# EasyEDA Pro project DreamFly.eprj, schematic Schematic1
Board Name: Board1; Create Date: 2024-08-14; Page Name: DreamFly Main Body; Project Name: DreamFly; Schematic Name: Schematic1; Update Date: 2024-12-17; Company: 嘉立创EDA; Drawed: 梅雨; Page Size: A4; Version: V1.0
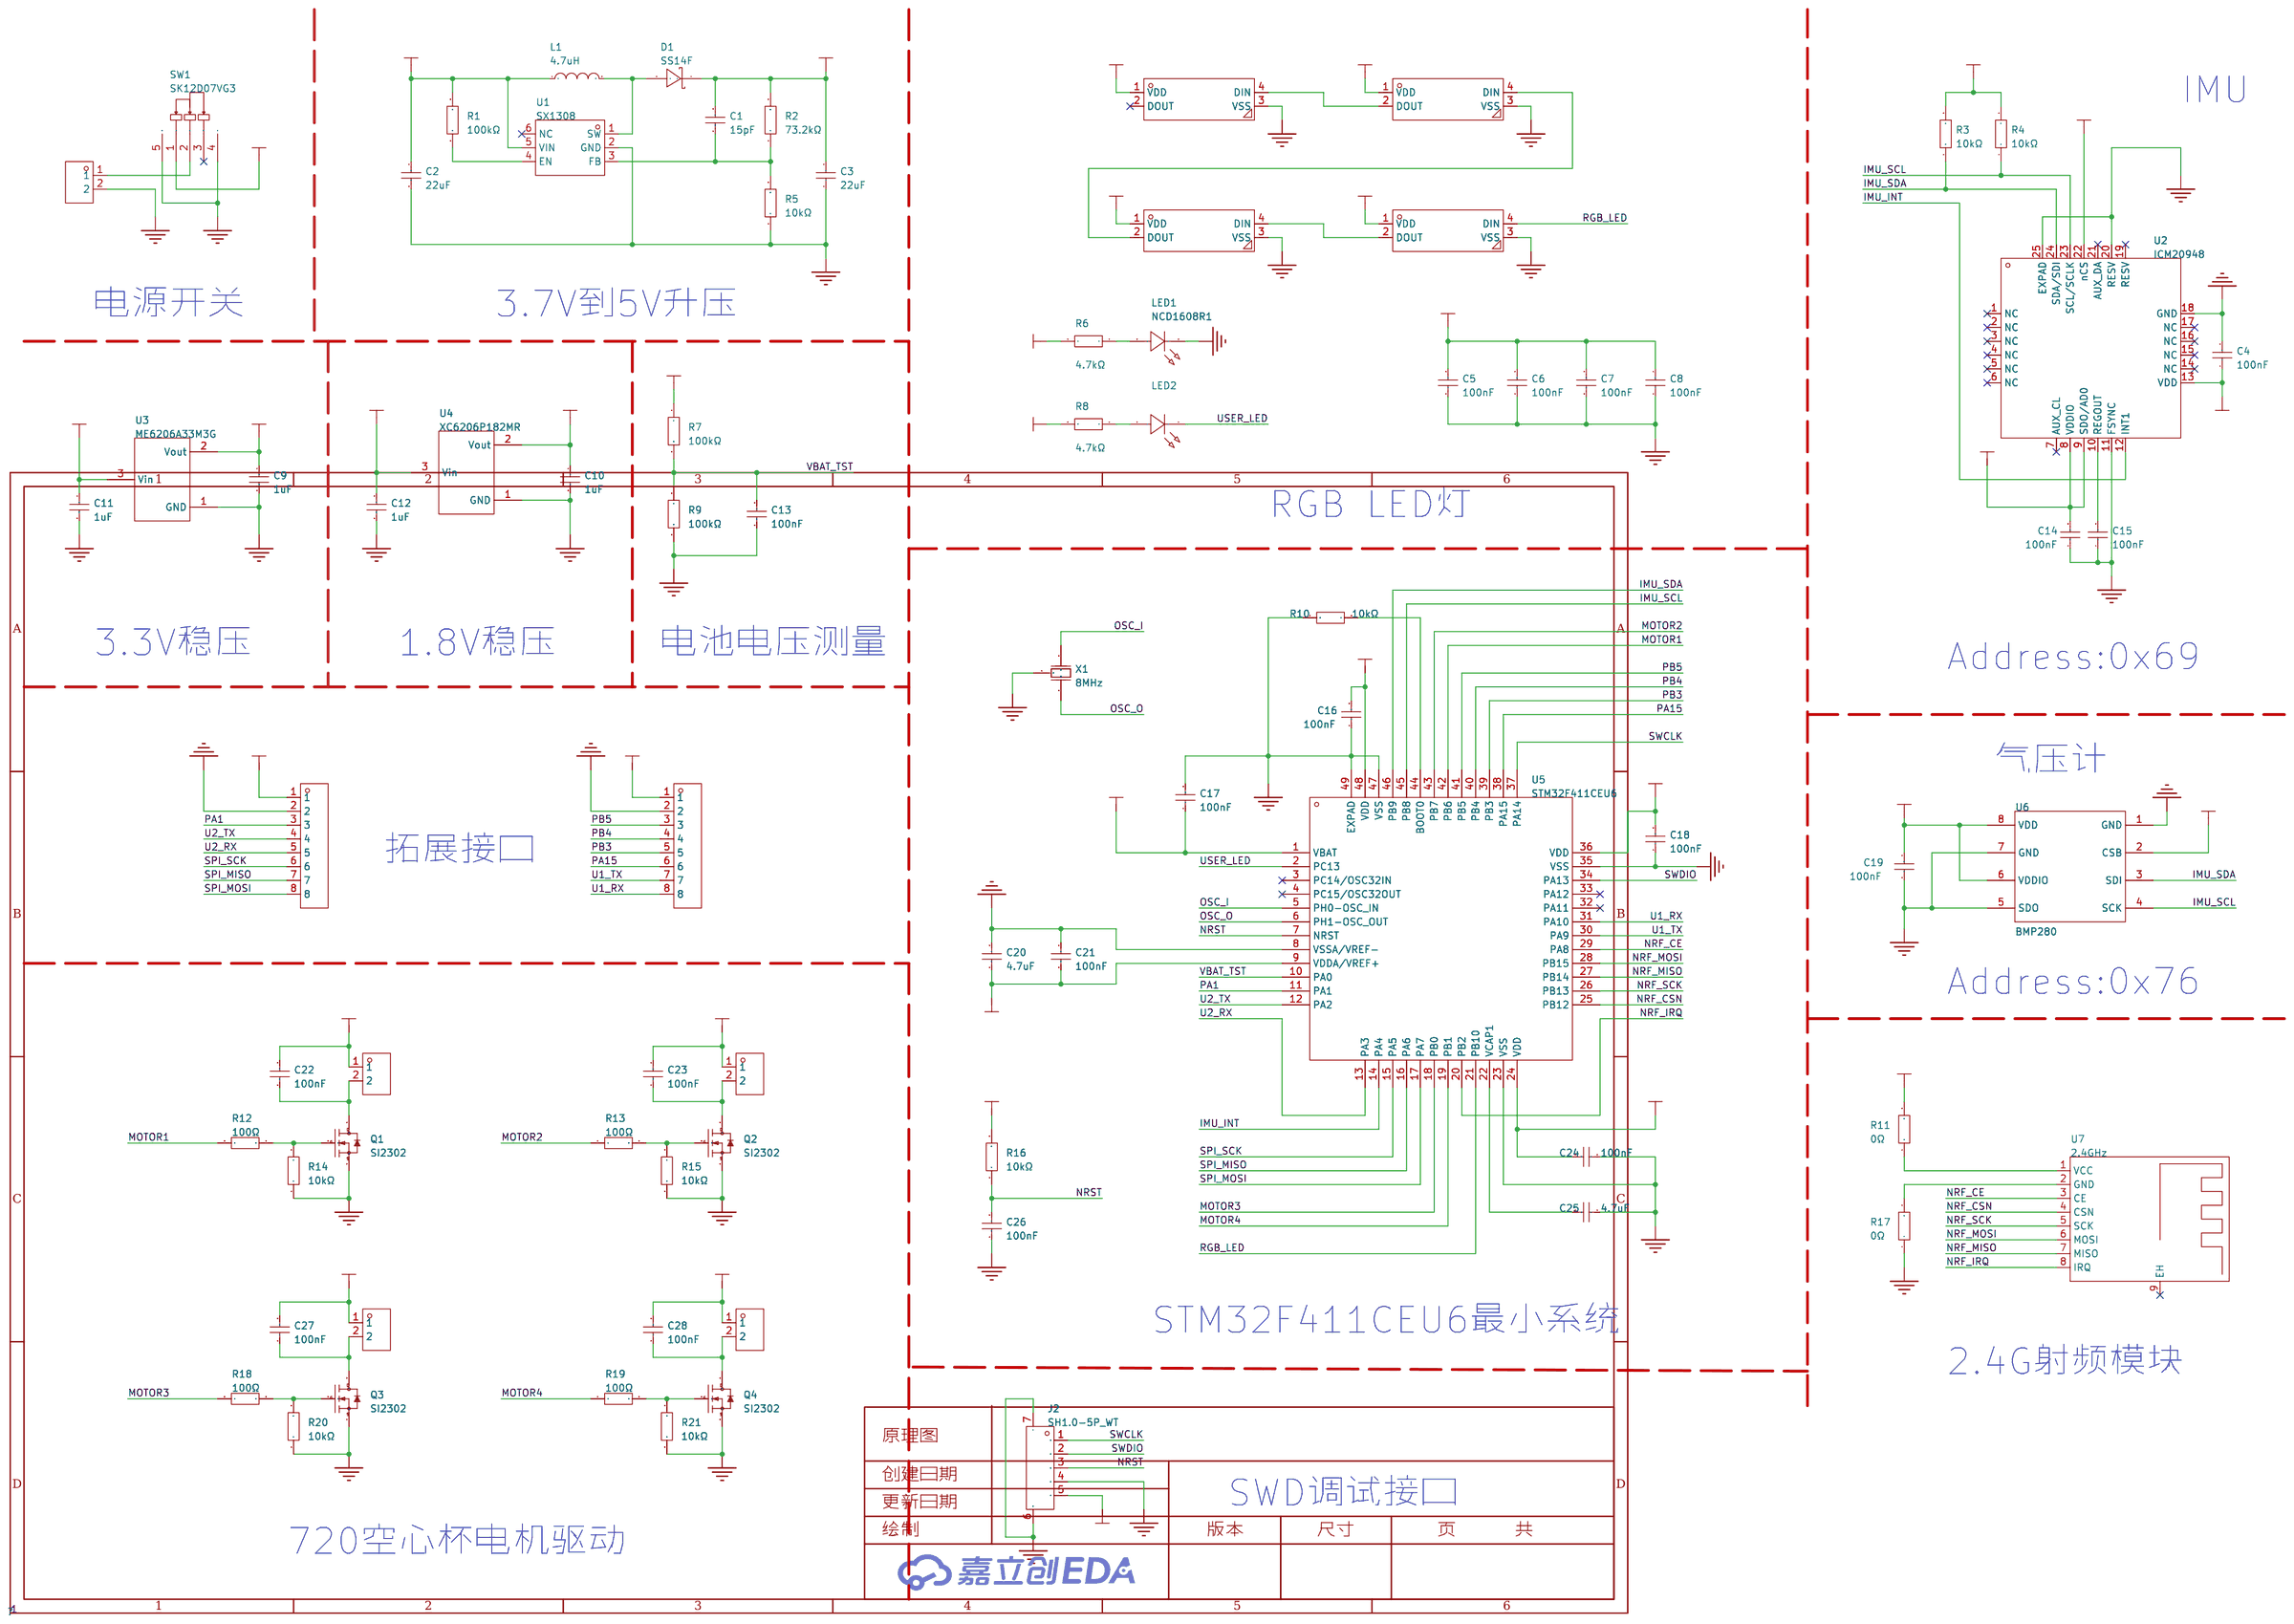
[diagram p0: schematic sheet]

## Parts
C1  15pF  [C0603]
C2  22uF  [C0603]
C3  22uF  [C0603]
C4  100nF  [C0603]
C5  100nF  [C0603]
C6  100nF  [C0603]
C7  100nF  [C0603]
C8  100nF  [C0603]
C9  1uF  [C0603]
C10  1uF  [C0603]
C11  1uF  [C0603]
C12  1uF  [C0603]
C13  100nF  [C0603]
C14  100nF  [C0603]
C15  100nF  [C0603]
C16  100nF  [C0603]
C17  100nF  [C0603]
C18  100nF  [C0603]
C19  100nF  [C0603]
C20  4.7uF  [C0603]
C21  100nF  [C0603]
C22  100nF  [C0603]
C23  100nF  [C0603]
C24  100nF  [C0603]
C25  4.7uF  [C0603]
C26  100nF  [C0603]
C27  100nF  [C0603]
C28  100nF  [C0603]
D1  SS14F  [SMAF_L3.5-W2.6-LS4.7-RD]
J1  BAT  [BAT]
J2  SH1.0-5P_WT  [CONN-SMD_5P-P1.00_BX-SH1.0-5PWT]
L1  4.7uH  [IND-SMD_L4.9-W4.4_MAPM0420F]
LED1  NCD1608R1  [LED0603-RD_RED]
LED2  NCD1608A1  [LED0603-RD]
M1  720_MOTOR  [motor]
M2  720_MOTOR  [motor]
M3  720_MOTOR  [motor]
M4  720_MOTOR  [motor]
P1  -  [header10-2.0mm]
P2  -  [header10-2.0mm]
Q1  SI2302  [SOT-23-3_L2.9-W1.3-P1.90-LS2.4-BR]
Q2  SI2302  [SOT-23-3_L2.9-W1.3-P1.90-LS2.4-BR]
Q3  SI2302  [SOT-23-3_L2.9-W1.3-P1.90-LS2.4-BR]
Q4  SI2302  [SOT-23-3_L2.9-W1.3-P1.90-LS2.4-BR]
R1  100kΩ  [R0603]
R2  73.2kΩ  [R0603]
R3  10kΩ  [R0603]
R4  10kΩ  [R0603]
R5  10kΩ  [R0603]
R6  4.7kΩ  [R0603]
R7  100kΩ  [R0603]
R8  4.7kΩ  [R0603]
R9  100kΩ  [R0603]
R10  10kΩ  [R0603]
R11  0Ω  [R0603]
R12  100Ω  [R0603]
R13  100Ω  [R0603]
R14  10kΩ  [R0603]
R15  10kΩ  [R0603]
R16  10kΩ  [R0603]
R17  0Ω  [R0603]
R18  100Ω  [R0603]
R19  100Ω  [R0603]
R20  10kΩ  [R0603]
R21  10kΩ  [R0603]
RGB1  WS2812B  [LED-SMD_4P-L5.0-W5.0-BL_TC5050RGB]
RGB2  WS2812B  [LED-SMD_4P-L5.0-W5.0-BL_TC5050RGB]
RGB3  WS2812B  [LED-SMD_4P-L5.0-W5.0-BL_TC5050RGB]
RGB4  WS2812B  [LED-SMD_4P-L5.0-W5.0-BL_TC5050RGB]
SW1  SK12D07VG3  [SW-TH_SK12D07VG3]
U1  SX1308  [SOT-23-6_L2.9-W1.6-P0.95-LS2.8-BL]
U2  ICM20948  [qfn24-0.4]
U3  ME6206A33M3G  [SOT-23-3_L2.9-W1.6-P1.90-LS2.8-BR]
U4  XC6206P182MR  [SOT-23-3_L2.9-W1.6-P1.90-LS2.8-BR]
U5  STM32F411CEU6  [qfn48]
U6  BMP280  [LGA-2_5X2MM]
U7  2.4GHz  [WIRELM-SMD_AI-THINKER_NF-03]
X1  8MHz  [OSC-SMD_3P-L3.2-W1.3-P1.20-L]

## Library data of the parts
C1 = CL10C150JB8NNNC: 容值:15pF;精度:±5%;额定电压:50V;材质(温度系数):C0G;; LCSC Part Name: 15pF ±5% 50V; Supplier Part: C1644; Manufacturer: SAMSUNG(三星); Supplier Footprint: 0603; JLCPCB Part Class: Basic Part; Datasheet: https://atta.szlcsc.com/upload/public/pdf/source/20160218/1457707763339.pdf; Supplier: LCSC; Tolerance: ±5%; Voltage Rated: 50V; Temperature Coefficient: C0G
C2 C3 = CL10A226MP8NUNE: 容值:22uF;精度:±20%;额定电压:10V;材质(温度系数):X5R;; LCSC Part Name: 22uF ±20% 10V; Supplier Part: C86295; Manufacturer: SAMSUNG(三星); Supplier Footprint: 0603; JLCPCB Part Class: Extended Part; Datasheet: https://atta.szlcsc.com/upload/public/pdf/source/20160218/1457707763339.pdf; Supplier: LCSC; Tolerance: ±20%; Voltage Rated: 10V; Temperature Coefficient: X5R
C4-C8 C13-C19 C21-C24 C26-C28 = CL10B104KB8NNNC: 容值:100nF;精度:±10%;额定电压:50V;材质(温度系数):X7R;; LCSC Part Name: 100nF ±10% 50V; Supplier Part: C1591; Manufacturer: SAMSUNG(三星); Supplier Footprint: 0603; JLCPCB Part Class: Extended Part; Datasheet: https://atta.szlcsc.com/upload/public/pdf/source/20160218/1457707763339.pdf; Supplier: LCSC; Tolerance: ±10%; Voltage Rated: 50V; Temperature Coefficient: X7R
C9-C12 = CL10A105KB8NNNC: 容值:1uF;精度:±10%;额定电压:50V;材质(温度系数):X5R;; LCSC Part Name: 1uF ±10% 50V; Supplier Part: C15849; Manufacturer: SAMSUNG(三星); Supplier Footprint: 0603; JLCPCB Part Class: Basic Part; Datasheet: https://atta.szlcsc.com/upload/public/pdf/source/20160218/1457707763339.pdf; Supplier: LCSC; Tolerance: ±10%; Voltage Rated: 50V; Temperature Coefficient: X5R
C20 C25 = CL10A475KP8NNNC: 容值:4.7uF;精度:±10%;额定电压:10V;材质(温度系数):X5R;; LCSC Part Name: 4.7uF ±10% 10V; Supplier Part: C1705; Manufacturer: SAMSUNG(三星); Supplier Footprint: 0603; JLCPCB Part Class: Extended Part; Datasheet: https://atta.szlcsc.com/upload/public/pdf/source/20160218/1457707763339.pdf; Supplier: LCSC; Tolerance: ±10%; Voltage Rated: 10V; Temperature Coefficient: X5R
D1 = SS14F_C64880: 正向压降(Vf):550mV@1A;直流反向耐压(Vr):40V;平均整流电流(Io):1A;; LCSC Part Name: 电压:40V 电流:1A; Supplier Part: C64880; Manufacturer: MDD; Supplier Footprint: SMAF; JLCPCB Part Class: 扩展库; Datasheet: https://atta.szlcsc.com/upload/public/pdf/source/20230823/E8EB324D9FAAE659A2B5393973A101D8.pdf; Supplier: LCSC; Forward Voltage (Vf@If): 550mV@1A; Reverse Voltage (Vr): 40V; Average Rectified Current (Io): 1A
J1 = BAT
J2 = BX-SH1.0-5PWT: 插针结构:1x5P;间距:1mm;安装方式:卧贴;参考系列:SH;总PIN数:5P;排数:1;每排PIN数:5;行距:-;额定电流:1A;触头材质:黄铜;触头镀层:锡;工作温度范围:-25℃~+85℃;; Supplier Part: C18077911; Manufacturer: Bossie(博锡); Supplier Footprint: SMD,P=1mm,卧贴; JLCPCB Part Class: Extended Part; Datasheet: https://atta.szlcsc.com/upload/public/pdf/source/20231017/4CDB0A212BD50B56D4BC69924E3F273B.pdf; Supplier: LCSC; Pins Structure: 1x5P; Pitch: 1mm; Mounting Style: 卧贴; Reference Series: SH; Number of Pins: 5P; Number of Rows: 1; Number of PINs Per Row: 5; Current Rating (Max): 1A; Contact Material: 黄铜; Contact Plating: 锡; Operating Temperature Range: -25℃~+85℃
L1 = HA42-4R7MT: LCSC Part Name: 4.7uH ±20% 3A; Supplier Part: C2936653; Manufacturer: FH(风华); Supplier Footprint: 0420; JLCPCB Part Class: 扩展库; Datasheet: https://atta.szlcsc.com/upload/public/pdf/source/20211228/DF5AAD1C624D1DACD739A51BD94418BC.pdf; Supplier: LCSC; Tolerance: ±20%; Rated Current: 2A; Saturation Current (Isat): 3A; DC Resistance (DCR): 150mΩ
LED1 = NCD1608R1: 发光颜色:橙红色;正向电压(VF):1.9V;功率:57mW;正向电流:5mA;主波长:625nm;二极管配置:-;透镜颜色:-;色温:-;发光强度:30mcd;发光角度:120°;载带方式:-;工作温度:-30℃~+85℃;; Supplier Part: C2917174; Manufacturer: 国星光电; Supplier Footprint: 0603; JLCPCB Part Class: 扩展库; Datasheet: https://atta.szlcsc.com/upload/public/pdf/source/20211124/3B62A3FE98FF7E40CFCCFB520391D3D0.pdf; Supplier: LCSC; Emitted Color: 橙红色; Forward Voltage (VF): 1.9V; Power Dissipation: 57mW; Forward Current: 5mA; Dominant Wavelength: 625nm; Peak Wavelength: 635nm; Luminous Intensity: 30mcd; Viewing Angle: 120°; Operating Temperature: -30℃~+85℃
LED2 = NCD1608A1: 灯头类型:-;发光颜色:冰蓝色;正向电压(VF):2.7V~3.3V;功率:82.5mW;正向电流:25mA;主波长:-;二极管配置:-;透镜颜色:雾状黄透镜;色温:-;发光强度:125mcd~260mcd;发光角度:130°;载带方式:-;工作温度:-40℃~+85℃;; Supplier Part: C5382145; Manufacturer: 国星光电; Supplier Footprint: 0603; Datasheet: https://atta.szlcsc.com/upload/public/pdf/source/20230320/57E8B4D582D472ED3A7933DBAC44AEC7.pdf; Supplier: LCSC; Emitted Color: 冰蓝色; Forward Voltage (VF): 2.7V~3.3V; Power Dissipation: 82.5mW; Forward Current: 25mA; Lens Color: 雾状黄透镜; Luminous Intensity: 125mcd~260mcd; Viewing Angle: 130°; Operating Temperature: -40℃~+85℃
M1-M4 = 1.25-2A: LCSC Part Name: 2P 1.25mm; Supplier Part: C2829702; Manufacturer: FG(富港); Supplier Footprint: 插件,P=1.25mm; JLCPCB Part Class: 扩展库; Supplier: LCSC
P1 P2 = PM200V-11-08-H43: 插孔结构:1x8P;间距:2mm;行距:-;圆孔/方孔:方孔;安装类型:直插;排数:单排;总孔位数:8P;额定电流:2A;额定电压:-;插孔方向:顶部;塑高:4.3mm;工作温度范围:-40℃~+105℃;; LCSC Part Name: 间距:2mm 1x8P 直插; Supplier Footprint: 插件,P=2mm; JLCPCB Part Class: 扩展库; Datasheet: https://atta.szlcsc.com/upload/public/pdf/source/20201127/C962324_279235CD91B6BC5DCAC73F646CF096CF.pdf; Holes Structure: 1x8P; Pitch: 2mm; Circular Hole / Square Hole: 方孔; Mounting Type: 直插; Number of Rows: 单排; Number of Holes: 8P; Current Rating (Max): 2A; Holes Direction: 顶部; Insulation Height: 4.3mm; Operating Temperature Range: -40℃~+105℃
Q1-Q4 = SI2302_C181087: 类型:1个N沟道;漏源电压(Vdss):20V;连续漏极电流(Id):2.1A;功率(Pd):400mW;导通电阻(RDS(on)@Vgs,Id):72mΩ@4.5V,3.6A;阈值电压(Vgs(th)@Id):1.2V@50uA;; LCSC Part Name: 1个N沟道 耐压:20V 电流:2.1A; Supplier Part: C181087; Manufacturer: Hottech(合科泰); Supplier Footprint: SOT-23; JLCPCB Part Class: 扩展库; Datasheet: https://atta.szlcsc.com/upload/public/pdf/source/20180131/C181087_15173931927061329216.pdf; Supplier: LCSC; Type: 1个N沟道; Drain Source Voltage (Vdss): 20V; Continuous Drain Current (Id): 2.1A; Power Dissipation (Pd): 400mW; Drain Source On Resistance (RDS(on)@Vgs,Id): 72mΩ@4.5V,3.6A; Gate Threshold Voltage (Vgs(th)@Id): 1.2V@50uA
R1 R7 R9 = 0603WAF1003T5E: 电阻类型:厚膜电阻;阻值:100kΩ;精度:±1%;功率:100mW;最大工作电压:75V;温度系数:±100ppm/℃;; LCSC Part Name: 100kΩ ±1% 100mW 厚膜电阻; Supplier Part: C25803; Manufacturer: UNI-ROYAL(厚声); Supplier Footprint: 0603; JLCPCB Part Class: Basic Part; Datasheet: https://atta.szlcsc.com/upload/public/pdf/source/20200306/C422600_1E6D84923E4A46A82E41ADD87F860B5C.pdf; Supplier: LCSC; Type: 厚膜电阻; Tolerance: ±1%; Power(Watts): 100mW; Overload Voltage (Max): 75V; Temperature Coefficient: ±100ppm/℃; Operating Temperature Range: -55℃~+155℃
R2 = 0603WAF7322T5E: 电阻类型:厚膜电阻;阻值:73.2kΩ;精度:±1%;功率:100mW;最大工作电压:75V;温度系数:±100ppm/℃;; LCSC Part Name: 73.2kΩ ±1% 100mW 厚膜电阻; Supplier Part: C14890; Manufacturer: UNI-ROYAL(厚声); Supplier Footprint: 0603; JLCPCB Part Class: Extended Part; Datasheet: https://atta.szlcsc.com/upload/public/pdf/source/20200306/C422600_1E6D84923E4A46A82E41ADD87F860B5C.pdf; Supplier: LCSC; Type: 厚膜电阻; Tolerance: ±1%; Power(Watts): 100mW; Overload Voltage (Max): 75V; Temperature Coefficient: ±100ppm/℃; Operating Temperature Range: -55℃~+155℃
R3 R4 R6 R8 = 0603WAF4701T5E: 电阻类型:厚膜电阻;阻值:4.7kΩ;精度:±1%;功率:100mW;最大工作电压:75V;温度系数:±100ppm/℃;; LCSC Part Name: 4.7kΩ ±1% 100mW 厚膜电阻; Supplier Part: C23162; Manufacturer: UNI-ROYAL(厚声); Supplier Footprint: 0603; JLCPCB Part Class: Basic Part; Datasheet: https://atta.szlcsc.com/upload/public/pdf/source/20200306/C422600_1E6D84923E4A46A82E41ADD87F860B5C.pdf; Supplier: LCSC; Type: 厚膜电阻; Tolerance: ±1%; Power(Watts): 100mW; Overload Voltage (Max): 75V; Temperature Coefficient: ±100ppm/℃; Operating Temperature Range: -55℃~+155℃
R5 R10 R14-R16 R20 R21 = 0603WAF1002T5E: 电阻类型:厚膜电阻;阻值:10kΩ;精度:±1%;功率:100mW;最大工作电压:75V;温度系数:±100ppm/℃;; LCSC Part Name: 厚膜电阻 10kΩ ±1% 100mW; Supplier Part: C25804; Manufacturer: UNI-ROYAL(厚声); Supplier Footprint: 0603; JLCPCB Part Class: Basic Part; Datasheet: https://atta.szlcsc.com/upload/public/pdf/source/20200306/C422600_1E6D84923E4A46A82E41ADD87F860B5C.pdf; Supplier: LCSC; Type: 厚膜电阻; Tolerance: ±1%; Power(Watts): 100mW; Overload Voltage (Max): 75V; Temperature Coefficient: ±100ppm/℃; Operating Temperature Range: -55℃~+155℃
R11 R17 = 0603WAF0000T5E: 电阻类型:厚膜电阻;阻值:0Ω;精度:±1%;功率:100mW;最大工作电压:75V;; LCSC Part Name: 0Ω ±1% 100mW 厚膜电阻; Supplier Part: C21189; Manufacturer: UNI-ROYAL(厚声); Supplier Footprint: 0603; JLCPCB Part Class: 基础库; Datasheet: https://atta.szlcsc.com/upload/public/pdf/source/20200306/C422600_1E6D84923E4A46A82E41ADD87F860B5C.pdf; Supplier: LCSC; Type: 厚膜电阻; Tolerance: ±1%; Power(Watts): 100mW; Overload Voltage (Max): 75V; Operating Temperature Range: -55℃~+155℃
R12 R13 R18 R19 = 0603WAF1000T5E: 电阻类型:厚膜电阻;阻值:100Ω;精度:±1%;功率:100mW;最大工作电压:75V;温度系数:±200ppm/℃;; LCSC Part Name: 100Ω ±1% 100mW 厚膜电阻; Supplier Part: C22775; Manufacturer: UNI-ROYAL(厚声); Supplier Footprint: 0603; JLCPCB Part Class: Basic Part; Datasheet: https://atta.szlcsc.com/upload/public/pdf/source/20200306/C422600_1E6D84923E4A46A82E41ADD87F860B5C.pdf; Supplier: LCSC; Type: 厚膜电阻; Tolerance: ±1%; Power(Watts): 100mW; Overload Voltage (Max): 75V; Temperature Coefficient: ±200ppm/℃; Operating Temperature Range: -55℃~+155℃
RGB1-RGB4 = WS2812B-B/W: 黑支架，适合黑色结构产品（注意防潮，请查阅规格书中对应具体内容）; LCSC Part Name: RGB三色; Manufacturer: worldsemi; Supplier Footprint: SMD5050; JLCPCB Part Class: 扩展库; Datasheet: https://atta.szlcsc.com/upload/public/pdf/source/20200615/C114586_26EB6813EC9F2A3F6C7FBB2AD75DE01F.pdf
SW1 = SK12D07VG3: 电路结构:单刀双掷;安装方式:侧插;开关颜色:-;额定电流(DC):500mA;额定电压(DC):50V;额定电流(AC):-;额定电压(AC):-;机械寿命:5千次;; LCSC Part Name: 两档位卧式拨动开关,柄长3MM; Supplier Part: C431547; Manufacturer: SHOU HAN(首韩); Supplier Footprint: 插件; JLCPCB Part Class: 扩展库; Datasheet: https://atta.szlcsc.com/upload/public/pdf/source/20190925/C431547_01B93C6F3FA5C09E15F8CCBF4E6DB91A.pdf; Supplier: LCSC; Circuit: 单刀双掷; Pin Style: PC引脚; Switch Length: 8.7mm; Switch Width: 4.4mm; Switch Height: 4.7mm; Mounting Style: 侧插; Current Rating (DC): 500mA; Voltage Rating (DC): 50V; Mechanical Life: 5千次; Operating Temperature: -10℃~+50℃
U1 = SX1308: 功能类型:升压型;输入电压:2V~24V;输出电压:28V;输出电流(最大值):-;; Supplier Part: C78162; Manufacturer: SX(硕芯科技); Supplier Footprint: SOT-23-6; JLCPCB Part Class: 扩展库; Datasheet: https://atta.szlcsc.com/upload/public/pdf/source/20160920/1474356679185.pdf; Supplier: LCSC; Function: 升压型; Input Voltage: 2V~24V; Output Voltage: 28V; Switching Frequency: 1.2MHz; Synchronous Rectification: 否; Number of Outputs: 1; Topology: 升压式; Switch tube (built-in/external): 内置
U2 = ICM20948: Supplier Part: C2683596; Supplier Footprint: DFN-24-EP(3.0x3.0); JLCPCB Part Class: 扩展库; Supplier: LCSC
U3 = ME6206A33M3G: 输出类型:固定;最大输入电压:6V;输出电压:3.3V;最大输出电流:300mA;电源纹波抑制比(PSRR):50dB@(1kHz);输出极性:正极;; LCSC Part Name: 输入6V 输出3.3V 300mA; Supplier Part: C35259; Manufacturer: MICRONE(南京微盟); Supplier Footprint: SOT-23-3L; JLCPCB Part Class: 扩展库; Datasheet: https://atta.szlcsc.com/upload/public/pdf/source/20160727/1469591428238.pdf; Supplier: LCSC; Output Type: 固定; Maximum Input Voltage: 6V; Output Voltage: 3.3V; MAX Output Current: 300mA; Power Supply Rejection Ratio (PSRR): 50dB@(1kHz); Dropout Voltage: 380mV@(200mA); Output Polarity: 正极; Number of Outputs: 1
U4 = XC6206P182MR_C21659: 输出类型:固定;最大输入电压:6V;输出电压:1.8V;最大输出电流:80mA;电源纹波抑制比(PSRR):-;输出极性:正极;; LCSC Part Name: 输入6V 输出1.8V 80mA; Supplier Part: C21659; Manufacturer: TOREX(特瑞仕); Supplier Footprint: SOT-23-3L; JLCPCB Part Class: 扩展库; Datasheet: https://atta.szlcsc.com/upload/public/pdf/source/20140319/1457707020604.pdf; Supplier: LCSC; Output Type: 固定; Maximum Input Voltage: 6V; Output Voltage: 1.8V; MAX Output Current: 80mA; Dropout Voltage: 780mV@(60mA); Output Polarity: 正极; Number of Outputs: 1
U5 = STM32F411CEU6: CPU内核:CM4;程序存储容量:512KB;RAM总容量:128KB;GPIO端口数量:36;工作电压范围:1.7V~3.6V;CPU最大主频:100MHz;程序存储器类型:FLASH;; Supplier Part: C60420; Manufacturer: ST(意法半导体); Supplier Footprint: UFQFPN-48(7x7); JLCPCB Part Class: 扩展库; Datasheet: https://atta.szlcsc.com/upload/public/pdf/source/20151026/1457707507170.pdf; Supplier: LCSC; CPU Core: CM4; Program Storage Size: 512KB; RAM Size: 128KB; GPIO Ports Number: 36; Operating Voltage Range: 1.7V~3.6V; CPU Maximum Speed: 100MHz; Program Memory Type: FLASH; Operating Temperature Range: -40℃~+85℃; ADC (Bit): 12bit; Universal Serial Bus: 有; Peripheral/Function: DMA；PWM; Watchdog: 有; Infrared Data Association: 有; Low-Voltage Detect: 有; Secure Digital Input and Output: 有; Direct Memory Access: 有; Internal Oscillator: 有
U6 = BMP280: Supplier Part: C83291; Manufacturer: Bosch(博世); Supplier Footprint: LGA-8(2x2.5); JLCPCB Part Class: 扩展库; Datasheet: https://atta.szlcsc.com/upload/public/pdf/source/20200702/C83291_F39E84AB7DFC569A4C7554F8659640A1.pdf; Supplier: LCSC
U7 = NF-03: 模式:收发;频率:2.4GHz;天线形式:板载PCB天线;接收灵敏度:-96dBm;; Supplier Part: C115101; Manufacturer: Ai-Thinker(安信可); Supplier Footprint: SMD,12x18mm; JLCPCB Part Class: 扩展库; Datasheet: https://atta.szlcsc.com/upload/public/pdf/source/20220526/9E7F9263C85C7028B5CF6858CF79F72F.pdf; Supplier: LCSC; Model: 收发; Modulation System: FSK；GFSK; Output Power  (Max): 7dBm; Support Interface: SPI; Operating Voltage: 1.9V~3.6V; Antenna Type: 板载PCB天线; Receive  Current: 15mA; Send  Current: 25mA; Sensitivity: -96dBm; Operating Temperature: -20℃~+70℃
X1 = CSTNE8M00GH5C000R0: 频率:8MHz;内置负载电容:33pF;谐振阻抗:40Ω;; LCSC Part Name: 8MHz ±0.07% 内置负载电容:33pF; Supplier Part: C341525; Manufacturer: muRata(村田); Supplier Footprint: SMD3213-3P; JLCPCB Part Class: Extended Part; Datasheet: https://atta.szlcsc.com/upload/public/pdf/source/20181211/C341525_832BA077079E4863A5153C1DB98581D5.pdf; Supplier: LCSC; Built-in Load Capacitance: 33pF; Resonant Impedance: 40Ω; Operating Temperature: -40℃~+125℃

## Nets
1V8: C10.1 C14.2 U2.8(VDDIO) U2.9(SDO/AD0) U2.22(nCS) U4.2(Vout)
3V3: C4.1 C9.1 C12.1 C16.2 C17.1 C18.2 C19.2 C20.1 C21.1 C24.2 J2.5 R3.2 R4.2 R6.2 R8.2 R11.2 R16.2 U2.13(VDD) U3.2(Vout) U4.3(Vin) U5.1(VBAT) U5.9(VDDA/VREF+) U5.24(VDD) U5.36(VDD) U5.48(VDD) U6.2(CSB) U6.6(VDDIO) U6.8(VDD)
5V: C1.2 C3.2 C5.2 C6.2 C7.2 C8.2 C11.1 D1.1(K) P2.1 R2.2 RGB1.1(VDD) RGB2.1(VDD) RGB3.1(VDD) RGB4.1(VDD) U3.3(Vin)
GND: C2.1 C3.1 C4.2 C5.1 C6.1 C7.1 C8.1 C9.2 C10.2 C11.2 C12.2 C13.1 C14.1 C15.1 C16.1 C17.2 C18.1 C19.1 C20.2 C21.2 C24.1 C25.1 C26.1 J1.2 J2.4 J2.6 J2.7 LED1.1(K) P1.2 P2.2 Q1.2(S) Q2.2(S) Q3.2(S) Q4.2(S) R5.1 R9.2 R10.1 R14.1 R15.1 R17.1 R20.1 R21.1 RGB1.3(VSS) RGB2.3(VSS) RGB3.3(VSS) RGB4.3(VSS) SW1.4 SW1.5 U1.2(GND) U2.11(FSYNC) U2.18(GND) U2.20(RESV) U2.25(EXPAD) U3.1(GND) U4.1(GND) U5.8(VSSA/VREF-) U5.23(VSS) U5.35(VSS) U5.47(VSS) U5.49(EXPAD) U6.1(GND) U6.5(SDO) U6.7(GND) X1.2(GND)
VBAT: C2.2 C22.2 C23.2 C27.2 C28.2 L1.1 M1.1 M2.1 M3.1 M4.1 P1.1 R1.2 R7.1 SW1.1 U1.5(VIN)
VBAT_TST: C13.2 R7.2 R9.1 U5.10(PA0)
IMU_INT: U2.12(INT1) U5.14(PA4)
IMU_SCL: R4.1 U2.23(SCL/SCLK) U5.45(PB8) U6.4(SCK)
IMU_SDA: R3.1 U2.24(SDA/SDI) U5.46(PB9) U6.3(SDI)
MOTOR1: R12.1 U5.42(PB6)
MOTOR2: R13.1 U5.43(PB7)
MOTOR3: R18.1 U5.18(PB0)
MOTOR4: R19.1 U5.19(PB1)
NRF_CE: U5.29(PA8) U7.3(CE)
NRF_CSN: U5.25(PB12) U7.4(CSN)
NRF_IRQ: U5.20(PB2) U7.8(IRQ)
NRF_MISO: U5.27(PB14) U7.7(MISO)
NRF_MOSI: U5.28(PB15) U7.6(MOSI)
NRF_SCK: U5.26(PB13) U7.5(SCK)
NRST: C26.2 J2.3 R16.1 U5.7(NRST)
OSC_I: U5.5(PH0-OSC_IN) X1.1(OSC1)
OSC_O: U5.6(PH1-OSC_OUT) X1.3(OSC2)
PA1: P1.3 U5.11(PA1)
PA15: P2.6 U5.38(PA15)
PB3: P2.5 U5.39(PB3)
PB4: P2.4 U5.40(PB4)
PB5: P2.3 U5.41(PB5)
RGB_LED: RGB4.4(DIN) U5.21(PB10)
SPI_MISO: P1.7 U5.16(PA6)
SPI_MOSI: P1.8 U5.17(PA7)
SPI_SCK: P1.6 U5.15(PA5)
SWCLK: J2.1 U5.37(PA14)
SWDIO: J2.2 U5.34(PA13)
U1_RX: P2.8 U5.31(PA10)
U1_TX: P2.7 U5.30(PA9)
U2_RX: P1.5 U5.13(PA3)
U2_TX: P1.4 U5.12(PA2)
USER_LED: LED2.1(-) U5.2(PC13)
$1N4534: C25.2 U5.22(VCAP1)
$1N4588: C15.2 U2.10(REGOUT)
$1N4610: R17.2 U7.2(GND)
$1N4612: R11.1 U7.1(VCC)
$1N4621: C1.1 R2.1 R5.2 U1.3(FB)
$1N4622: D1.2(A) L1.2 U1.1(SW)
$1N4623: R1.1 U1.4(EN)
$1N4634: J1.1 SW1.2
$1N4636: LED1.2(A) R6.1
$1N4641: Q1.1(G) R12.2 R14.2
$1N4654: C22.1 M1.2 Q1.3(D)
$1N4655: C23.1 M2.2 Q2.3(D)
$1N4656: C27.1 M3.2 Q3.3(D)
$1N4657: Q2.1(G) R13.2 R15.2
$1N4658: Q4.1(G) R19.2 R21.2
$1N4659: Q3.1(G) R18.2 R20.2
$1N4660: C28.1 M4.2 Q4.3(D)
$1N4662: LED2.2(+) R8.1
$1N4664: RGB1.4(DIN) RGB2.2(DOUT)
$1N4665: RGB2.4(DIN) RGB3.2(DOUT)
$1N4667: RGB3.4(DIN) RGB4.2(DOUT)
$1N53848: R10.2 U5.44(BOOT0)

Not connected (* = marked no-connect by the designer): RGB1 2(DOUT)*; SW1 3*; U1 6(NC)*; U2 1(NC)* 2(NC)* 3(NC)* 4(NC)* 5(NC)* 6(NC)* 7(AUX_CL)* 14(NC)* 15(NC)* 16(NC)* 17(NC)* 19(RESV)* 21(AUX_DA)*; U5 3(PC14/OSC32IN)* 4(PC15/OSC32OUT)* 32(PA11)* 33(PA12)*; U7 9(EH)*

## Notes on the sheet
- IMU
- 电源开关
- 3.7V到5V升压
- RGB LED灯
- 3.3V稳压
- 1.8V稳压
- 电池电压测量
- Address:0x69
- 气压计
- 拓展接口
- Address:0x76
- STM32F411CEU6最小系统
- 2.4G射频模块
- SWD调试接口
- 720空心杯电机驱动
